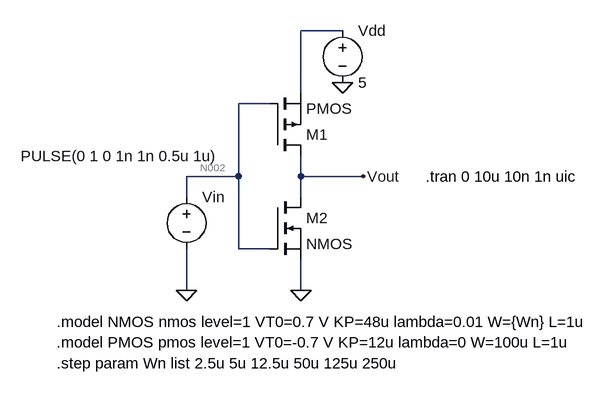
[diagram p0: schematic schema 1.4.2.asc]
schema 1.4.2.asc, the LTspice schematic file:
Version 4
SHEET 1 880 680
WIRE 320 -96 256 -96
WIRE 256 0 256 -96
WIRE 208 16 160 16
WIRE 160 128 160 16
WIRE 160 128 80 128
WIRE 256 128 256 96
WIRE 352 128 256 128
WIRE 80 160 80 128
WIRE 256 160 256 128
WIRE 160 240 160 128
WIRE 208 240 160 240
WIRE 80 304 80 240
WIRE 256 304 256 256
FLAG 352 128 Vout
FLAG 256 304 0
FLAG 320 -16 0
FLAG 80 304 0
SYMBOL nmos 208 160 R0
SYMATTR InstName M2
SYMBOL voltage 320 -112 R0
SYMATTR InstName Vdd
SYMATTR Value 5
SYMBOL voltage 80 144 R0
WINDOW 3 -255 -47 Left 2
WINDOW 123 0 0 Left 0
WINDOW 39 0 0 Left 0
SYMATTR Value PULSE(0 1 0 1n 1n 0.5u 1u)
SYMATTR InstName Vin
SYMBOL pmos 208 96 M180
SYMATTR InstName M1
TEXT -120 352 Left 2 !.model NMOS nmos level=1 VT0=0.7 V KP=48u lambda=0.01 W={Wn} L=1u
TEXT -120 384 Left 2 !.model PMOS pmos level=1 VT0=-0.7 V KP=12u lambda=0 W=100u L=1u
TEXT 448 128 Left 2 !.tran 0 10u 10n 1n uic
TEXT -120 416 Left 2 !.step param Wn list 2.5u 5u 12.5u 50u 125u 250u

The netlist it stands for:
* schema 1.4.2.asc
M2 Vout N002 0 0 NMOS
Vdd N001 0 5
Vin N002 0 PULSE(0 1 0 1n 1n 0.5u 1u)
M1 Vout N002 N001 N001 PMOS
.model NMOS NMOS
.model PMOS PMOS
.lib standard.mos
.model NMOS nmos level=1 VT0=0.7 V KP=48u lambda=0.01 W={Wn} L=1u
.model PMOS pmos level=1 VT0=-0.7 V KP=12u lambda=0 W=100u L=1u
.tran 0 10u 10n 1n uic
.step param Wn list 2.5u 5u 12.5u 50u 125u 250u
.backanno
.end

* Results of the author's LTspice run, read from the files saved beside the schematic
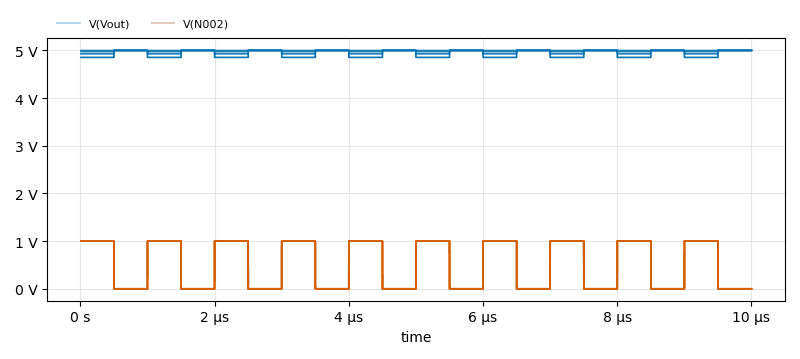
[diagram p1: Transient Analysis of schema 1.4.2.asc, plotted from the saved traces]
* Transient Analysis, 6 runs:
*   V(Vout) [wn=2.5e-006]: min 4.999 V, max 5 V, average 4.999 V, rms 4.999 V, last 5 V
*   V(Vout) [wn=5e-006]: min 4.997 V, max 5 V, average 4.999 V, rms 4.999 V, last 5 V
*   V(Vout) [wn=1.25e-005]: min 4.993 V, max 5 V, average 4.996 V, rms 4.996 V, last 5 V
*   V(Vout) [wn=5e-005]: min 4.971 V, max 5 V, average 4.986 V, rms 4.986 V, last 5 V
*   V(Vout) [wn=0.000125]: min 4.928 V, max 5 V, average 4.964 V, rms 4.964 V, last 5 V
*   V(Vout) [wn=0.00025]: min 4.854 V, max 5.001 V, average 4.927 V, rms 4.927 V, last 5 V
*   V(N002) [wn=2.5e-006]: min 0 V, max 1 V, average 500.6 mV, rms 707.3 mV, last 0 V
*   V(N002) [wn=5e-006]: min 0 V, max 1 V, average 500.6 mV, rms 707.3 mV, last 0 V
*   V(N002) [wn=1.25e-005]: min 0 V, max 1 V, average 500.6 mV, rms 707.3 mV, last 0 V
*   V(N002) [wn=5e-005]: min 0 V, max 1 V, average 500.6 mV, rms 707.3 mV, last 0 V
*   V(N002) [wn=0.000125]: min 0 V, max 1 V, average 500.6 mV, rms 707.3 mV, last 0 V
*   V(N002) [wn=0.00025]: min 0 V, max 1 V, average 500.6 mV, rms 707.3 mV, last 0 V